# Altium schematic sheet 06_WS2812.SchDoc
size A4
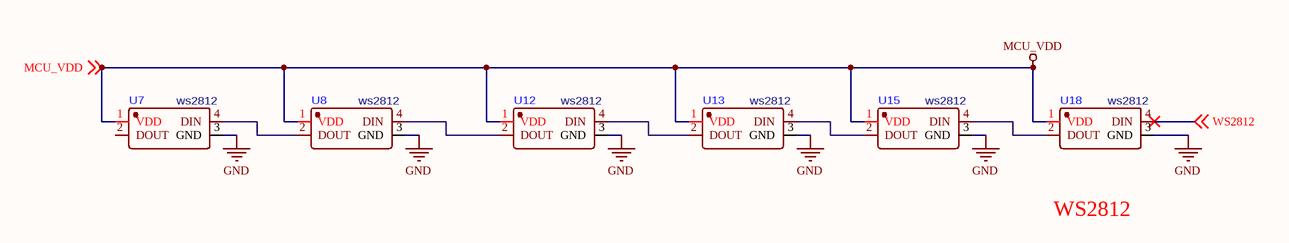
[diagram p0: 06_WS2812.SchDoc]

## Parts
U7  ws2812  [WS2812B(3528)]
U8  ws2812  [WS2812B(3528)]
U12  ws2812  [WS2812B(3528)]
U13  ws2812  [WS2812B(3528)]
U15  ws2812  [WS2812B(3528)]
U18  ws2812  [WS2812B(3528)]

## Nets
GND: U7.3(GND) U8.3(GND) U12.3(GND) U13.3(GND) U15.3(GND) U18.3(GND)
MCU_VDD: U7.1(VDD) U8.1(VDD) U12.1(VDD) U13.1(VDD) U15.1(VDD) U18.1(VDD) ; off-sheet MCU_VDD
WS2812: U18.4(DIN) ; off-sheet WS2812
NetU7_4: U7.4(DIN) U8.2(DOUT)
NetU8_4: U8.4(DIN) U12.2(DOUT)
NetU12_4: U12.4(DIN) U13.2(DOUT)
NetU13_4: U13.4(DIN) U15.2(DOUT)
NetU15_4: U15.4(DIN) U18.2(DOUT)

Not connected (* = marked no-connect by the designer): U7 2(DOUT)

## Notes on the sheet
- WS2812

## Library data of the parts
U7 U8 U12 U13 U15 U18 = YOTC-WS2812B-3528: ws2812_3528